# EAGLE schematic InputSel (EAGLE 6.1)
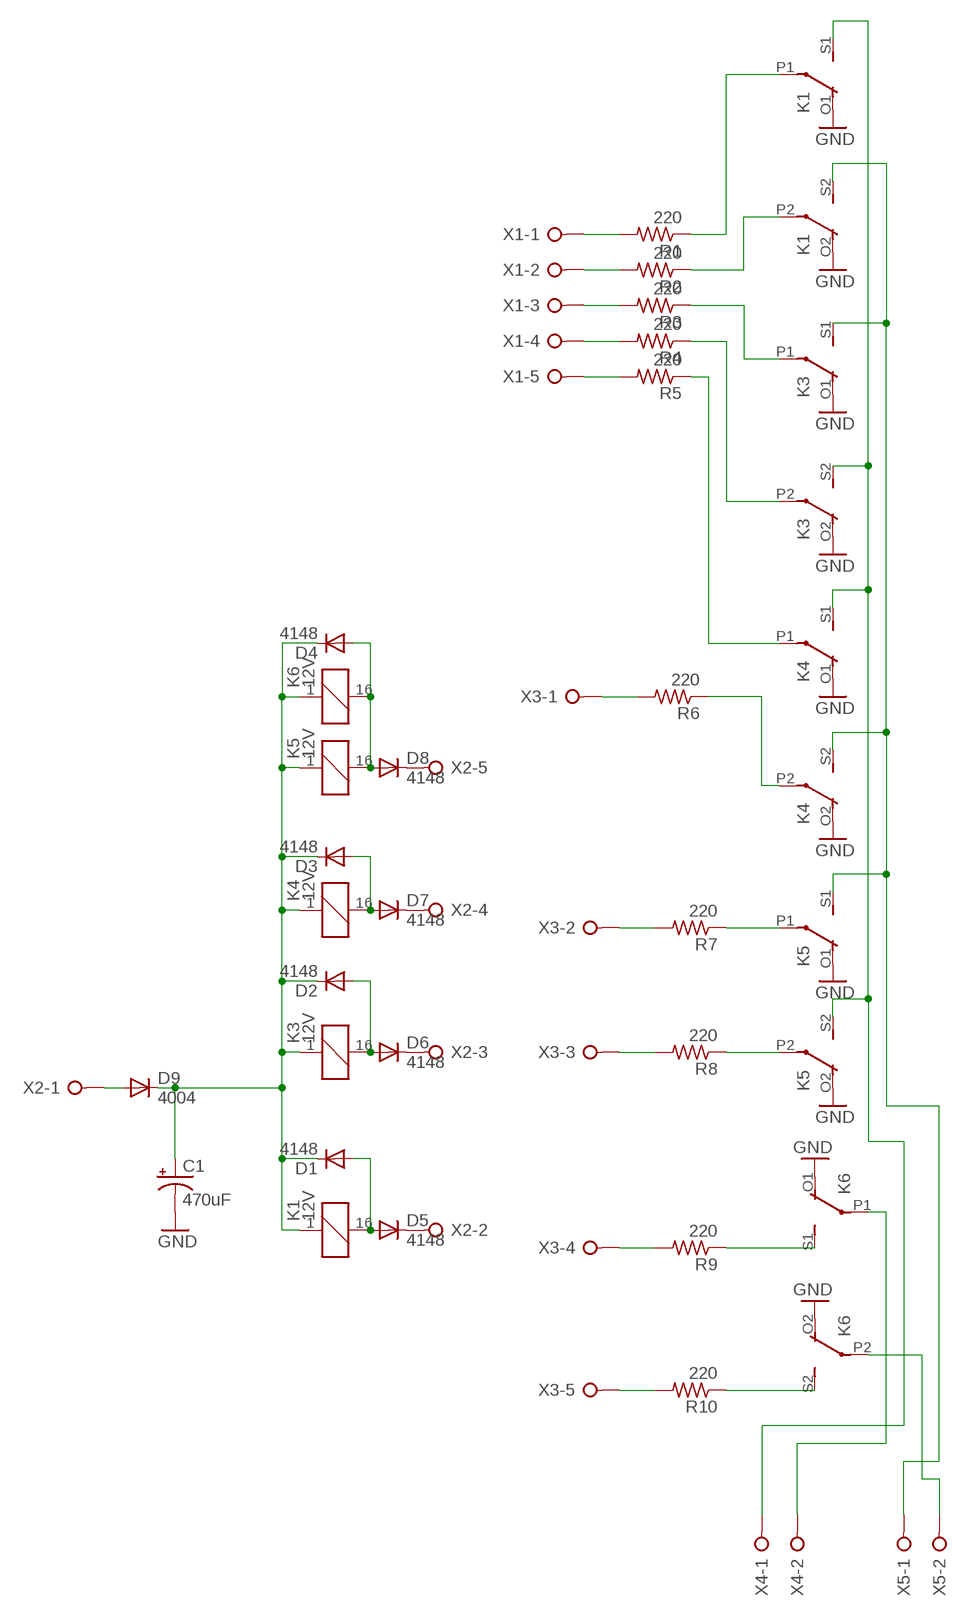
[diagram p0: schematic, sheet 1]

## Parts
C1  470uF  CPOL-USE5-10.5  [E5-10,5]
D1  4148  1N4148DO35-7  [DO35-7]
D2  4148  1N4148DO35-7  [DO35-7]
D3  4148  1N4148DO35-7  [DO35-7]
D4  4148  1N4148DO35-7  [DO35-7]
D5  4148  1N4148DO35-7  [DO35-7]
D6  4148  1N4148DO35-7  [DO35-7]
D7  4148  1N4148DO35-7  [DO35-7]
D8  4148  1N4148DO35-7  [DO35-7]
D9  4004  1N4148DO35-10  [DO35-10]
K1  12V  G6A-234P  [G6A-234P]
K3  12V  G6A-234P  [G6A-234P]
K4  12V  G6A-234P  [G6A-234P]
K5  12V  G6A-234P  [G6A-234P]
K6  12V  G6A-234P  [G6A-234P]
R1  220  R-US_0207/10  [0207/10]
R2  220  R-US_0207/10  [0207/10]
R3  220  R-US_0207/10  [0207/10]
R4  220  R-US_0207/10  [0207/10]
R5  220  R-US_0207/10  [0207/10]
R6  220  R-US_0207/10  [0207/10]
R7  220  R-US_0207/10  [0207/10]
R8  220  R-US_0207/10  [0207/10]
R9  220  R-US_0207/10  [0207/10]
R10  220  R-US_0207/10  [0207/10]
X1  W237-05P  [W237-5P]
X2  W237-05P  [W237-5P]
X3  W237-05P  [W237-5P]
X4  W237-02P  [W237-132]
X5  W237-02P  [W237-132]

## Nets
GND: C1.- K1.O1(2:O) K1.O2(3:O) K3.O1(2:O) K3.O2(3:O) K4.O1(2:O) K4.O2(3:O) K5.O1(2:O) K5.O2(3:O) K6.O1(2:O) K6.O2(3:O)
N$1: K3.P1(2:P) R3.1
N$2: R1.2 X1.1
N$3: K3.P2(3:P) R4.1
N$4: R2.2 X1.2
N$5: K1.S1(2:S) K3.S2(3:S) K4.S1(2:S) K5.S2(3:S) X4.1
N$6: R3.2 X1.3
N$7: R4.2 X1.4
N$8: K1.S2(3:S) K3.S1(2:S) K4.S2(3:S) K5.S1(2:S) X5.1
N$9: K1.P2(3:P) R2.1
N$10: K1.P1(2:P) R1.1
N$11: R5.2 X1.5
N$12: K4.P1(2:P) R5.1
N$13: K5.P2(3:P) R8.1
N$14: K5.P1(2:P) R7.1
N$15: K4.P2(3:P) R6.1
N$16: R6.2 X3.1
N$17: R7.2 X3.2
N$18: R8.2 X3.3
N$19: R9.2 X3.4
N$20: K6.S1(2:S) R9.1
N$21: R10.2 X3.5
N$22: K6.S2(3:S) R10.1
N$23: C1.+ D1.C D2.C D3.C D4.C D9.C K1.1 K3.1 K4.1 K5.1 K6.1
N$24: K6.P1(2:P) X4.2
N$25: K6.P2(3:P) X5.2
N$26: D4.A D8.A K5.16 K6.16
N$27: D1.A D5.A K1.16
N$28: D2.A D6.A K3.16
N$29: D3.A D7.A K4.16
N$30: D5.C X2.2
N$31: D6.C X2.3
N$32: D8.C X2.5
N$33: D7.C X2.4
N$34: D9.A X2.1

## Library data of the parts
C1 = resistor:CPOL-US: POLARIZED CAPACITOR, American symbol
D1-D9 = diode:1N4148: DIODE high speed (Philips)
K1 K3-K6 = relay:G6A-234P: RELAY 2 x switch, 0.3 A/125 V AC, 1 A/30 V DC, Omron; OC_FARNELL: unknown; OC_NEWARK: unknown
R1-R10 = resistor:R-US_: RESISTOR, American symbol
X1-X3 = con-wago-508:W237-05P: WAGO SREW CLAMP; OC_FARNELL: unknown; OC_NEWARK: unknown
X4 X5 = con-wago-508:W237-02P: WAGO SREW CLAMP; OC_FARNELL: unknown; OC_NEWARK: unknown